# Altium schematic sheet modFOC-IO.SchDoc: modFOC-IO
size A4; Author: Thomas Hofmann; CompanyName: HTL St. Pölten; Organization: Altium Limited; Address1: modFOC; Address2: Frenchs Forest; Address3: NSW; Address4: Australia 2086; DocumentNumber: 5; Revision: 2.0; SheetNumber: 5; SheetTotal: 7
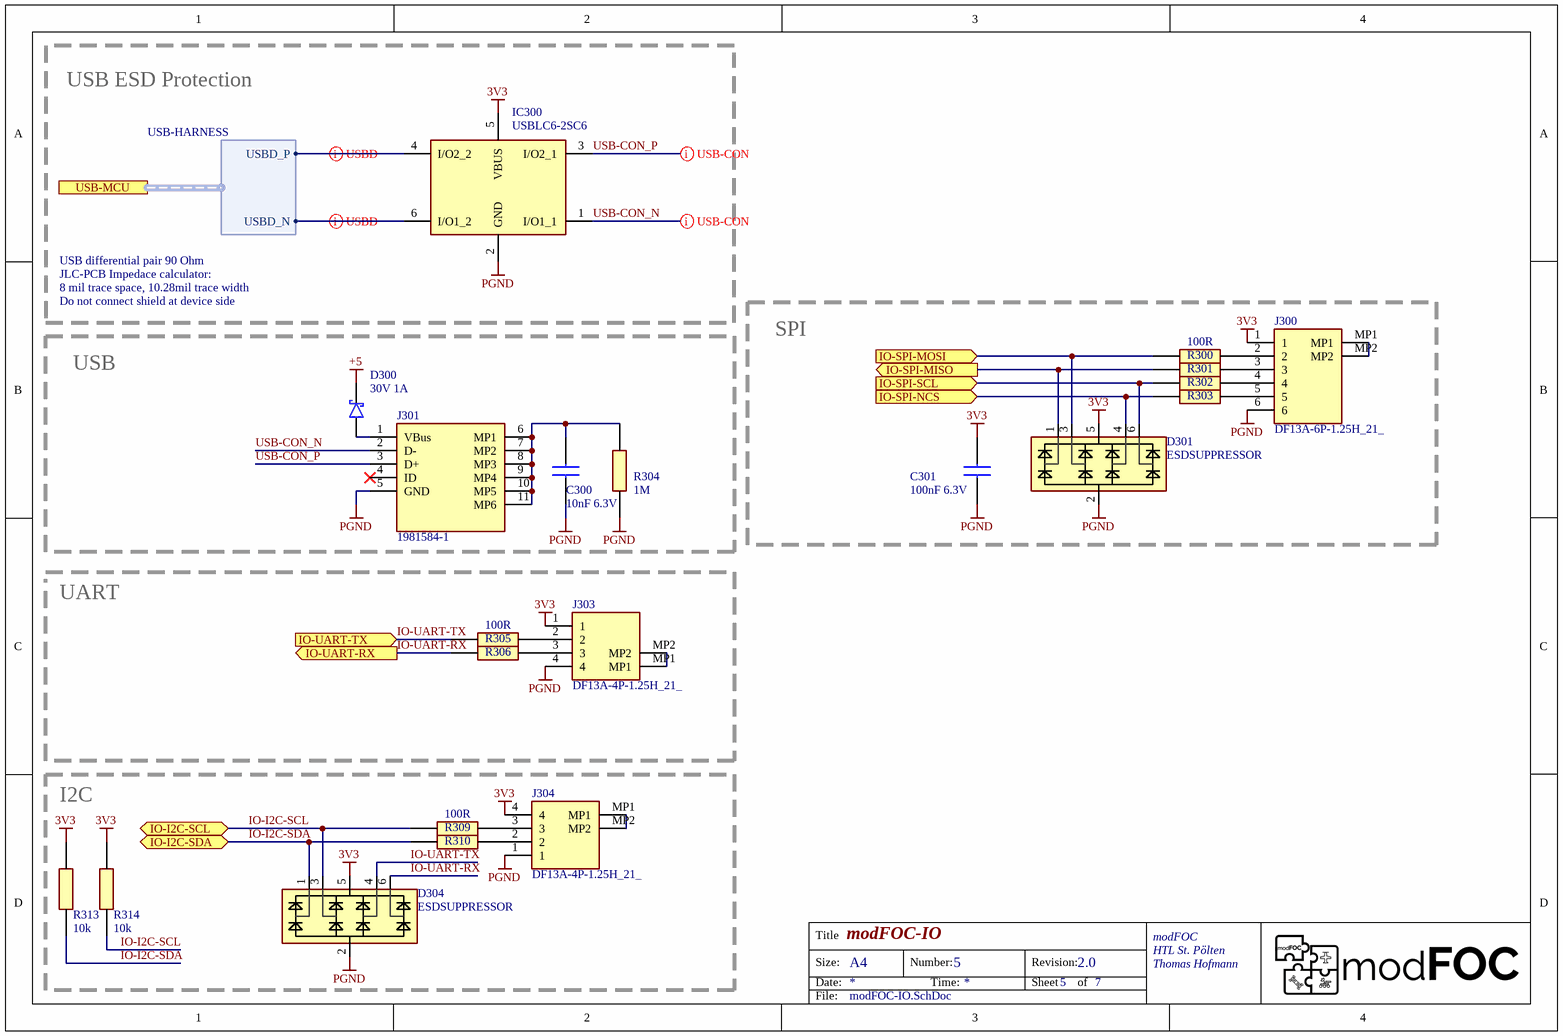
[diagram p0: modFOC-IO.SchDoc]

## Parts
C300  10nF 6.3V  [CAPC1608X97N]
C301  100nF 6.3V  [CAPC1608X97N]
D300  30V 1A  [SOD-323]
D301  ESDSUPPRESSOR  [SOT23-6]
D304  ESDSUPPRESSOR  [SOT23-6]
IC300  USBLC6-2SC6  [SOT95P280X145-6N]
J300  DF13A-6P-1.25H_21_  [DF13A6P125H21]
J301  1981584-1  [19815841]
J303  DF13A-4P-1.25H_21_  [DF13A4P125H21]
J304  DF13A-4P-1.25H_21_  [DF13A4P125H21]
R300  100R  [RESC1005X40N]
R301  100R  [RESC1005X40N]  (value not drawn)
R302  100R  [RESC1005X40N]  (value not drawn)
R303  100R  [RESC1005X40N]  (value not drawn)
R304  1M  [RESC1608X50N]
R305  100R  [RESC1005X40N]
R306  100R  [RESC1005X40N]  (value not drawn)
R309  100R  [RESC1005X40N]
R310  100R  [RESC1005X40N]  (value not drawn)
R313  10k  [RESC1608X50N]
R314  10k  [RESC1608X50N]

## Blocks framed on the sheet
SPI: C301 D301 J300 R300-R303
USB: C300 D300 J301 R304
I2C: D304 J304 R309 R310 R313 R314

## Ports
IO-I2C-SCL (bidir), IO-I2C-SDA (bidir), IO-SPI-MISO (out), IO-SPI-MOSI (in), IO-SPI-NCS (in), IO-SPI-SCL (in), IO-UART-RX (out), IO-UART-TX (in), USB-MCU (harness USB-HARNESS)

## Harnesses
USB-HARNESS: USBD_P, USBD_N

## Nets
3V3: C301.2 D301.5(VDD) D304.5(VDD) IC300.5(VBUS) J300.1 J303.1 J304.4 R313.1 R314.1
+5: D300.1(K)
PGND: C300.1 C301.1 D301.2(GND) D304.2(GND) IC300.2(GND) J300.6 J301.5(GND) J303.4 J304.1 R304.1
IO-I2C-SCL: D304.3(CH2) R309.1 R314.2 ; port IO-I2C-SCL
IO-I2C-SDA: D304.1(CH1) R310.1 R313.2 ; port IO-I2C-SDA
IO-SPI-MISO: D301.1(CH1) R301.1 ; port IO-SPI-MISO
IO-SPI-MOSI: D301.3(CH2) R300.1 ; port IO-SPI-MOSI
IO-SPI-NCS: D301.4(CH3) R303.1 ; port IO-SPI-NCS
IO-SPI-SCL: D301.6(CH4) R302.1 ; port IO-SPI-SCL
IO-UART-RX: D304.6(CH4) R306.1 ; port IO-UART-RX
IO-UART-TX: D304.4(CH3) R305.1 ; port IO-UART-TX
USB-CON_N: IC300.1(I/O1_1) J301.2(D-)
USB-CON_P: IC300.3(I/O2_1) J301.3(D+)
NetC300_2: C300.2 J301.6(MP1) J301.7(MP2) J301.8(MP3) J301.9(MP4) J301.10(MP5) J301.11(MP6) R304.2
NetD300_2: D300.2(A) J301.1(VBus)
NetIC300_4: IC300.4(I/O2_2) ; port USB-MCU.USBD_P
NetIC300_6: IC300.6(I/O1_2) ; port USB-MCU.USBD_N
NetJ300_2: J300.2 R300.2
NetJ300_3: J300.3 R301.2
NetJ300_4: J300.4 R302.2
NetJ300_5: J300.5 R303.2
NetJ300_MP1: J300.MP1 J300.MP2
NetJ303_2: J303.2 R305.2
NetJ303_3: J303.3 R306.2
NetJ303_MP1: J303.MP1 J303.MP2
NetJ304_2: J304.2 R310.2
NetJ304_3: J304.3 R309.2
NetJ304_MP1: J304.MP1 J304.MP2

Not connected (* = marked no-connect by the designer): J301 4(ID)*

## Layout directives
differential pair: NetIC300_4, NetIC300_6, USB-CON_N, USB-CON_P

## Notes on the sheet
- USB ESD Protection
- USB differential pair 90 Ohm
- JLC-PCB Impedace calculator:
- Do not connect shield at device side
- 8 mil trace space, 10.28mil trace width
- UART
- Title
- Size:
- Date:
- A4
- Number:
- Time:
- Revision:
- Sheet
- of
- File:

## Library data of the parts
C300 C301 = C0603: Capacitor; Height: 0.97
D300 = SCHOTTKY-DIODE: Schottky Diode
D301 D304 = ESDSUPPRESSOR: TVS Diode Array; Height: 0.6mm
IC300 = USBLC6-2SC6: Integrated Circuit; Manufacturer_Name: STMicroelectronics; Datasheet Link: http://www.st.com/st-web-ui/static/active/en/resource/technical/document/datasheet/CD00050750.pdf; Height: 1.45mm; Manufacturer_Part_Number: USBLC6-2SC6; Arrow Part Number: USBLC6-2SC6; Arrow Price/Stock: https://www.arrow.com/en/products/usblc6-2sc6/stmicroelectronics; Mouser Part Number: 511-USBLC6-2SC6; Mouser Price/Stock: https://www.mouser.co.uk/ProductDetail/STMicroelectronics/USBLC6-2SC6?qs=po45yt2pPpu%2FhNIlwQdTlg%3D%3D
J300 = DF13A-6P-1.25H_21_: Connector; Manufacturer_Name: Hirose; Manufacturer_Part_Number: DF13A-6P-1.25H(21); Datasheet Link: https://www.hirose.com/product/download/?distributor=digikey&type=2d&lang=en&num=DF13A-6P-1.25H(21); Height: 3.75mm; Mouser Part Number: 798-DF13A6P125H21; Mouser Price/Stock: https://www.mouser.co.uk/ProductDetail/Hirose-Connector/DF13A-6P-125H21?qs=XQjbzJWzFPXnreVi%252BPl0Lg%3D%3D; Arrow Part Number: DF13A-6P-1.25H(21); Arrow Price/Stock: https://www.arrow.com/en/products/df13a-6p-1.25h-21/hirose-electric
J301 = 1981584-1: Connector; Manufacturer_Name: TE Connectivity; Datasheet Link: http://www.te.com/commerce/DocumentDelivery/DDEController?Action=showdoc&DocId=Customer+Drawing%7F1981584%7FD2%7Fpdf%7FEnglish%7FENG_CD_1981584_D2.pdf%7F1981584-1; Height: 3mm; Manufacturer_Part_Number: 1981584-1; Arrow Part Number: 1981584-1; Arrow Price/Stock: https://www.arrow.com/en/products/1981584-1/te-connectivity; Mouser Part Number: 571-1981584-1; Mouser Price/Stock: https://www.mouser.co.uk/ProductDetail/TE-Connectivity/1981584-1?qs=ozkTL%2FUej0TLYxjQLPnd2Q%3D%3D
J303 J304 = DF13A-4P-1.25H_21_: Connector; Manufacturer_Name: Hirose; Manufacturer_Part_Number: DF13A-4P-1.25H(21); Datasheet Link: https://componentsearchengine.com/Datasheets/1/DF13A-4P-1.25H(21).pdf; Height: 3.6mm; Mouser Part Number: 798-DF13A4P125H21; Mouser Price/Stock: https://www.mouser.co.uk/ProductDetail/Hirose-Connector/DF13A-4P-125H21?qs=XQjbzJWzFPXWzMShI70F0w%3D%3D
R300-R303 R305 R306 R309 R310 = R0402: Resistor; Height: 0.4mm
R304 R313 R314 = R0603: Resistor; Height: 0.55mm